# Altium schematic sheet 3_BUS_UART_ISO_Communication.schdoc
size 297 x 209 mm; Symbol: sucaimuban; Company: 嘉立创EDA; Version: V1.0; Page Size: A4; @Project Name: 26gsSucaiku; @Update Date: 2026-06-27; @Create Date: 2026-06-21; Device: sucaimuban; @Board Name: Sucaiku; @Page Name: BUS/UART_ISO_Communication; @Create Time: 21:33:33; @Page Count: 7; @Page No: 3; @Schematic Name: Schematic1; @Update Time: 20:01:32; @Assembly Variant: Basic; Border: 1; Title Block Position: 3; Size: A4; Width: 1170; Height: 825; Region Start: 1; X Region Count: 6; Y Region Count: 4; Blade Width: 10
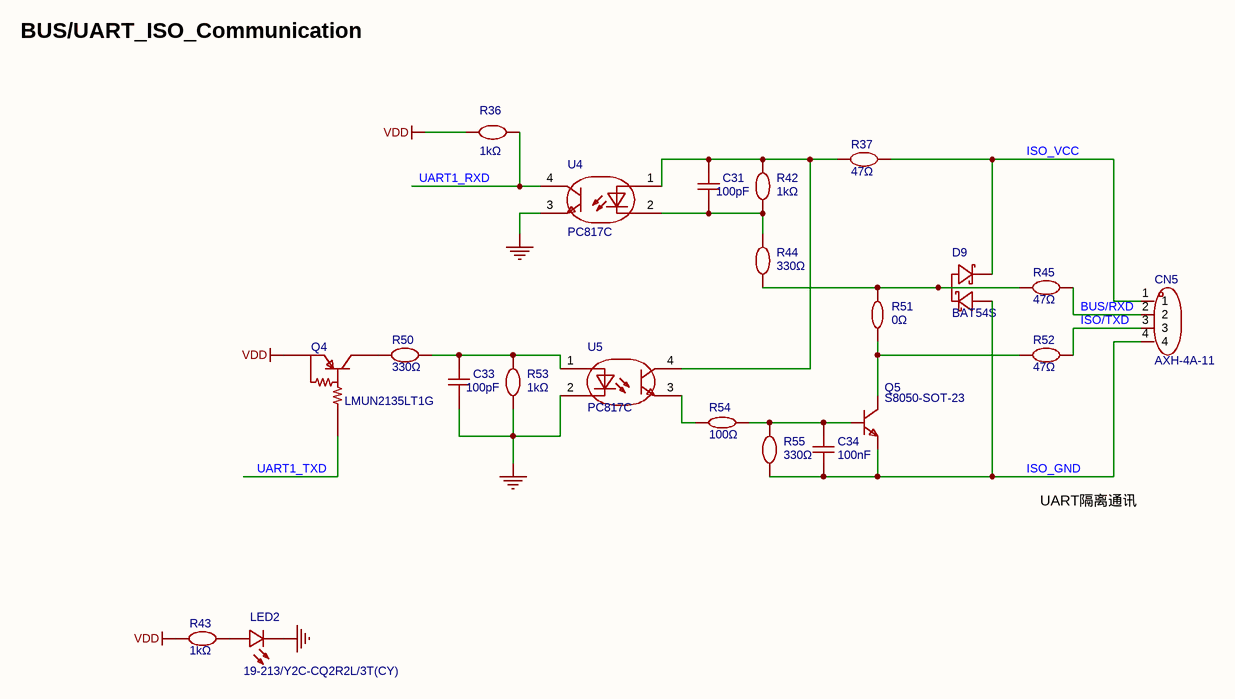
[diagram p0: 3_BUS_UART_ISO_Communication.schdoc]

## Parts
C31  100pF  [C0603]
C33  100pF  [C0603]
C34  100nF  [C0603]
CN5  AXH-4A-11  [CONN-TH_KH-XH-4A-Z]
D9  BAT54S  [SOT-23-3_L2.9-W1.3-P1.90-LS2.4-BR]
LED2  19-213/Y2C-CQ2R2L/3T(CY)  [LED0603-RD-YELLOW]
Q4  LMUN2135LT1G  [SOT-23-3_L2.9-W1.3-P1.90-LS2.4-BR]
Q5  S8050-SOT-23  [SOT-23-3_L2.9-W1.3-P1.90-LS2.5-BR]
R36  1kΩ  [R0603]
R37  47Ω  [R1206]
R42  1kΩ  [R0603]
R43  1kΩ  [R0603]
R44  330Ω  [R0805]
R45  47Ω  [R1206]
R50  330Ω  [R0805]
R51  0Ω  [R0603]
R52  47Ω  [R1206]
R53  1kΩ  [R0603]
R54  100Ω  [R0805]
R55  330Ω  [R0805]
U4  PC817C  [OPTO-SMD-4_L4.6-W6.5-P2.54-LS10.3-TL]
U5  PC817C  [OPTO-SMD-4_L4.6-W6.5-P2.54-LS10.3-TL]

## Nets
GND: C33.1 LED2.1(C) R53.1 U4.3 U5.2
VDD: Q4.2(E) R36.1 R43.2
BUS/RXD: CN5.2 R45.2
ISO/TXD: CN5.3 R52.2
ISO_GND: C34.2 CN5.4 D9.1(A) Q5.2(E) R55.1
ISO_VCC: CN5.1 D9.2(K) R37.2
UART1_RXD: R36.2 U4.4
UART1_TXD: Q4.1(B)
NetC31_1: C31.1 R42.1 R44.2 U4.2
NetC31_2: C31.2 R37.1 R42.2 U4.1 U5.4
NetC33_2: C33.2 R50.1 R53.2 U5.1
NetC34_1: C34.1 Q5.1(B) R54.2 R55.2
NetD9_3: D9.3 R44.1 R45.1 R51.2
NetLED2_2: LED2.2(A) R43.1
NetQ4_3: Q4.3(C) R50.2
NetQ5_3: Q5.3(C) R51.1 R52.1
NetR54_1: R54.1 U5.3

## Notes on the sheet
- BUS/UART_ISO_Communication
- UART隔离通讯
- 身份证号
- 选手姓名
- 手 机 号
- 图页名称
- 第                      幅
- 工程名称
- 共                    幅
- 当前日期
- 当前时间

## Library data of the parts
C31 C33 = CC0603JRNPO9BN101: 容值:100pF;精度:±5%;额定电压:50V;温度系数:NP0;; Manufacturer: YAGEO(国巨); AddInBom: yes; ModelId: ac125912035d415993ca9572d50418b1聨0819f05c4eef4c71ace90d822a990e87; ModelName: C0603_L1.6-W0.8-H0.8; ModelTransform: 62.992,31.496,0,0,0,0,0,0,0; Tolerance: ±5%; Voltage Rating: 50V; Temperature Coefficient: NP0; Symbol: CC0603JRNPO9BN101; Device: CC0603JRNPO9BN101; LCSC Part Name: 100pF ±5% 50V; SupplierPart: C14665; ManufacturerPart: CC0603JRNPO9BN101; Supplier Footprint: 0603; JLCPCB Part Class: Extended Part; Datasheet: https://item.szlcsc.com/datasheet/CC0603JRNPO9BN101/15333.html; Supplier: LCSC; ConvertToPcb: yes; FootprintName: C0603; Value: 100pF
C34 = CL10B104KB8NNNC: 容值:100nF;精度:±10%;额定电压:50V;温度系数:X7R;; Manufacturer: SAMSUNG(三星); AddInBom: yes; ModelId: ac125912035d415993ca9572d50418b1聨0819f05c4eef4c71ace90d822a990e87; ModelName: C0603_L1.6-W0.8-H0.8; ModelTransform: 62.992,31.496,0,0,0,0,0,0,0; Tolerance: ±10%; Voltage Rating: 50V; Temperature Coefficient: X7R; Symbol: CL10B104KB8NNNC; Device: CL10B104KB8NNNC; LCSC Part Name: 100nF ±10% 50V; SupplierPart: C1591; ManufacturerPart: CL10B104KB8NNNC; Supplier Footprint: 0603; JLCPCB Part Class: Extended Part; Datasheet: https://item.szlcsc.com/datasheet/CL10B104KB8NNNC/1943.html; Supplier: LCSC; ConvertToPcb: yes; FootprintName: C0603; Value: 100nF
CN5 = AXH-4A-11: 插针结构:1x4P;间距:2.5mm;安装方式:直插;参考系列:XH;总PIN数:4P;排数:1;每排PIN数:4;行距:2.5mm;额定电流:2A;触头材质:黄铜;触头镀层:锡;工作温度:-25℃~+85℃;; Manufacturer: JXTCONN(聚兴泰); AddInBom: yes; ModelId: 9492b9b5a702460f82b1decd06d0892a聨0819f05c4eef4c71ace90d822a990e87; ModelTransform: 492.125,232.283,0,0,0,0,0,21.654,-137.795; Pins Structure: 1x4P; Pitch: 2.5mm; Reference Series: XH; Number of PINs Per Row: 4; Current Rating: 2A; Voltage Rating: 250V; Plastic Material: PA66; Flame Retardant Rating: UL94V-0; Z-Height of the Board: 7mm; X-Length of Bottom Edge on Board (Spacing Line): 12.5mm; Y-Width of Bottom Edge on Board: 5.9mm; Symbol: AXH-4A-11; Device: AXH-4A-11; LCSC Part Name: 1x4P 间距:2.5mm 直插 系列:XH; SupplierPart: C42422439; ManufacturerPart: AXH-4A-11; Supplier Footprint: 插件,P=2.54mm; JLCPCB Part Class: Extended Part; Datasheet: https://item.szlcsc.com/datasheet/AXH-4A-11/44442050.html; Supplier: LCSC; ConvertToPcb: yes; FootprintName: CONN-TH_KH-XH-4A-Z; ModelName: CONN-TH_KH-XH-4A-Z; Mounting Type: 直插; Number of Pins: 4P; Number of Rows: 1; Row Spacing: 2.5mm; Contact Material: 黄铜; Contact Plating: 锡; Operating Temperature: -25℃~+85℃; Supplementary Features: -; Color: 白色
D9 = BAT54S_C916425: 二极管配置:1对串联式;正向压降(Vf):800mV@100mA;直流反向耐压(Vr):30V;整流电流:200mA;; Manufacturer: JSMSEMI(杰盛微); AddInBom: yes; ModelId: c62791f0466c4ae2a892c056b845b0ca聨0819f05c4eef4c71ace90d822a990e87; ModelName: SOT-23-3P_L2.9-W1.3-H1.0-LS2.4-P0.95; ModelTransform: 98.425,114.173,0,180,0,0,0.0005,-0.0005,0; Diode Configuration: 1对串联式; Voltage - DC Reverse(Vr): 30V; Current - Rectified: 200mA; Reverse Leakage Current (Ir): 2uA@25V; Non-Repetitive Peak Forward Surge Current: 600mA; Symbol: BAT54S_C916425; Device: BAT54S_C916425; LCSC Part Name: 电压:30V 电流:200mA; SupplierPart: C916425; ManufacturerPart: BAT54S; Supplier Footprint: SOT-23; JLCPCB Part Class: Extended Part; Datasheet: https://item.szlcsc.com/datasheet/BAT54S/990921.html; Supplier: LCSC; ConvertToPcb: yes; FootprintName: SOT-23-3_L2.9-W1.3-P1.90-LS2.4-BR; Voltage - Forward(Vf@If): 800mV@100mA
LED2 = 19-213/Y2C-CQ2R2L/3T(CY): 灯头类型:-;发光颜色:黄色;正向压降(Vf):1.7V~2.3V;功率:60mW;正向电流:20mA;波长:585.5nm~591.5nm;二极管配置:-;透镜颜色:无色透明透镜;色温:-;发光强度:90mcd~180mcd;发光角度:120°;载带方式:-;工作温度:-40℃~+85℃;; Manufacturer: EVERLIGHT(亿光); AddInBom: yes; ModelId: a8fc7d5425514cf49dd600af0a7bb223聨0819f05c4eef4c71ace90d822a990e87; ModelTransform: 63.7794,32.283,0,0,0,0,-1.969,0,0; Illumination Color: 黄色; Power(Watts): 60mW; Forward Current: 20mA; Peak Wavelength: 591nm; Lens Color: 无色透明透镜; Viewing Angle: 120°; Symbol: 19-213/Y2C-CQ2R2L/3T(CY); Device: 19-213/Y2C-CQ2R2L/3T(CY); LCSC Part Name: 黄灯; SupplierPart: C72038; ManufacturerPart: 19-213/Y2C-CQ2R2L/3T(CY); Supplier Footprint: 0603; JLCPCB Part Class: Extended Part; Supplier: LCSC; ConvertToPcb: yes; FootprintName: LED0603-RD-YELLOW; ModelName: LED0603-RD-YELLOW; Lamp Holder Type: -; Voltage - Forward(Vf): 1.7V~2.3V; Wavelength - Dominant: 585.5nm~591.5nm; Diode Configuration: -; Color Temperature: -; Luminous Intensity: 90mcd~180mcd; Mounting Style: -; Operating Temperature: -40℃~+85℃
Q4 = LMUN2135LT1G: 数量:-;集射极击穿电压(Vceo):50V;集电极电流(Ic):100mA;耗散功率(Pd):246mW;直流电流增益(hFE):80@5.0mA,10V;; Manufacturer: LRC(乐山无线电); AddInBom: yes; ModelId: c62791f0466c4ae2a892c056b845b0ca聨0819f05c4eef4c71ace90d822a990e87; ModelName: SOT-23-3P_L2.9-W1.3-H1.0-LS2.4-P0.95; ModelTransform: 98.425,114.173,0,180,0,0,0.0005,-0.0005,0; Collector - Emitter Voltage VCEO: 50V; Current - Collector(Ic): 100mA; Pd - Power Dissipation: 246mW; type: PNP; Output Voltage(VO(on)): 200mV; Input Resistor: 2.2kΩ; Resistor Ratio: 0.047; Symbol: LMUN2135LT1G; Device: LMUN2135LT1G; LCSC Part Name: 偏置电阻晶体管; SupplierPart: C136189; ManufacturerPart: LMUN2135LT1G; Supplier Footprint: SOT-23; JLCPCB Part Class: Extended Part; Datasheet: https://item.szlcsc.com/datasheet/LMUN2135LT1G/147503.html; Supplier: LCSC; ConvertToPcb: yes; FootprintName: SOT-23-3_L2.9-W1.3-P1.90-LS2.4-BR; Number: -; DC Current Gain: 80@5.0mA,10V; Operating Temperature: -55℃~+150℃
Q5 = S8050-SOT-23: 晶体管类型：NPN。                 集电极电流ICM:0.5A                   集电极-基极击穿电压BVCBO:40V         集电极-发射极击穿电压BVCEO:25V       直流电流增益HFE:200-350                        丝印：J3Y; Manufacturer: DDF(鼎德丰); AddInBom: yes; ModelId: 6ea1b42e609b4c388d37f6ca14da8e20聨0819f05c4eef4c71ace90d822a990e87; ModelTransform: 114.173,98.425,0,90,0,0,0.001,-0.001,0; Symbol: S8050-SOT-23; Device: S8050-SOT-23; LCSC Part Name: S8050-SOT-23; SupplierPart: C50229533; ManufacturerPart: S8050-SOT-23; Supplier Footprint: SOT-23; JLCPCB Part Class: Extended Part; Datasheet: https://item.szlcsc.com/datasheet/S8050-SOT-23/52814686.html; Supplier: LCSC; ConvertToPcb: yes; FootprintName: SOT-23-3_L2.9-W1.3-P1.90-LS2.5-BR; ModelName: SOT-23-3_L2.9-W1.3-P1.90-LS2.5-BR
R36 R42 R43 R53 = AST031KF: 阻值:1kΩ;精度:±1%;功率:100mW;工作电压:75V;温度系数:±100ppm/℃;; Manufacturer: HKR(香港电阻); 3D Model: fc143cca1e79419f9cd78b61e9279f08聨0819f05c4eef4c71ace90d822a990e87; 3D Model Transform: 31.8897,63.7794,0,90,0,0,0,0,0; Tolerance: ±1%; Power(Watts): 100mW; Voltage-Supply(Max): 75V; AddInBom: yes; Symbol: AST031KF; Device: AST031KF; LCSC Part Name: 1K ±1%; Supplier Part: C49330120; Manufacturer Part: AST031KF; Supplier Footprint: 0603; JLCPCB Part Class: Extended Part; Datasheet: https://item.szlcsc.com/datasheet/AST031KF/51811762.html; Supplier: LCSC; Value: 1kΩ; Temperature Coefficient: ±100ppm/℃; Operating Temperature: -55℃~+155℃; ConvertToPcb: yes; FootprintName: R0603; ModelName: R0603
R37 R45 R52 = FRC1206J470 TS: 电阻类型:厚膜电阻;阻值:47Ω;精度:±5%;功率:250mW;工作电压:200V;温度系数:±100ppm/℃;; Manufacturer: FOJAN(富捷); AddInBom: yes; ModelId: 89a1f13db2384da588040e0b3c55bf66聨0819f05c4eef4c71ace90d822a990e87; ModelName: R1206_L3.2-W1.6-H0.6; ModelTransform: 125.984,62.992,0,0,0,0,0,0,0; Tolerance: ±5%; Power(Watts): 250mW; Voltage-Supply(Max): 200V; Symbol: FRC1206J470 TS; Device: FRC1206J470 TS; LCSC Part Name: 47Ω ±5% 250mW 厚膜电阻; SupplierPart: C2907508; ManufacturerPart: FRC1206J470 TS; Supplier Footprint: 1206; JLCPCB Part Class: Extended Part; Supplier: LCSC; ConvertToPcb: yes; FootprintName: R1206; Type: 厚膜电阻; Value: 47Ω; Temperature Coefficient: ±100ppm/℃; Operating Temperature: -55℃~+155℃
R44 R50 R55 = FRC0805J331 TS: 电阻类型:厚膜电阻;阻值:330Ω;精度:±5%;功率:125mW;工作电压:150V;温度系数:±100ppm/℃;; Manufacturer: FOJAN(富捷); AddInBom: yes; ModelId: 37a81e68749a4138bd2dfa6897b24b85聨0819f05c4eef4c71ace90d822a990e87; ModelName: R0805_L2.0-W1.3-H0.6; ModelTransform: 78.74,51.181,0,0,0,0,0,-0.0005,0; Tolerance: ±5%; Power(Watts): 125mW; Voltage-Supply(Max): 150V; Symbol: FRC0805J331 TS; Device: FRC0805J331 TS; LCSC Part Name: 330Ω ±5% 125mW 厚膜电阻; SupplierPart: C2907321; ManufacturerPart: FRC0805J331 TS; Supplier Footprint: 0805; JLCPCB Part Class: Extended Part; Supplier: LCSC; ConvertToPcb: yes; FootprintName: R0805; Type: 厚膜电阻; Value: 330Ω; Temperature Coefficient: ±100ppm/℃; Operating Temperature: -55℃~+155℃
R51 = RC0603JR-070RL: 电阻类型:厚膜电阻;阻值:0Ω;精度:±5%;功率:100mW;工作电压:75V;温度系数:-;; Manufacturer: YAGEO(国巨); AddInBom: yes; ModelId: fc143cca1e79419f9cd78b61e9279f08聨0819f05c4eef4c71ace90d822a990e87; ModelTransform: 31.8897,63.7794,0,90,0,0,0,0,0; Tolerance: ±5%; Power(Watts): 100mW; Voltage-Supply(Max): 75V; Symbol: RC0603JR-070RL; Device: RC0603JR-070RL; LCSC Part Name: 厚膜电阻 0Ω ±5% 100mW; SupplierPart: C95177; ManufacturerPart: RC0603JR-070RL; Supplier Footprint: 0603; JLCPCB Part Class: Extended Part; Datasheet: https://item.szlcsc.com/datasheet/RC0603JR-070RL/96378.html; Supplier: LCSC; ConvertToPcb: yes; FootprintName: R0603; ModelName: R0603; Type: 厚膜电阻; Value: 0Ω; Temperature Coefficient: -; Operating Temperature: -55℃~+155℃
R54 = AC0805FR-07100RL: 电阻类型:厚膜电阻;阻值:100Ω;精度:±1%;功率:125mW;工作电压:150V;温度系数:±100ppm/℃;; Manufacturer: YAGEO(国巨); AddInBom: yes; ModelId: 37a81e68749a4138bd2dfa6897b24b85聨0819f05c4eef4c71ace90d822a990e87; ModelName: R0805_L2.0-W1.3-H0.6; ModelTransform: 78.74,51.181,0,0,0,0,0,-0.0005,0; Tolerance: ±1%; Power(Watts): 125mW; Voltage-Supply(Max): 150V; Symbol: AC0805FR-07100RL; Device: AC0805FR-07100RL; LCSC Part Name: 厚膜电阻 100Ω ±1% 125mW; SupplierPart: C138274; ManufacturerPart: AC0805FR-07100RL; Supplier Footprint: 0805; JLCPCB Part Class: Extended Part; Datasheet: https://item.szlcsc.com/datasheet/AC0805FR-07100RL/149590.html; Supplier: LCSC; ConvertToPcb: yes; FootprintName: R0805; Type: 厚膜电阻; Value: 100Ω; Temperature Coefficient: ±100ppm/℃; Operating Temperature: -55℃~+155℃
U4 U5 = PC817C_C3025164: 输入类型:DC;正向压降(Vf):1.2V;输出电流:50mA;隔离电压(Vrms):5kV;直流反向耐压(Vr):6V;负载电压:35V;输出通道数:1;集射极饱和电压(VCE(sat)):100mV@1mA,20mA;; Manufacturer: GOODWORK(固得沃克); AddInBom: yes; ModelId: 2d94a81bf94f4608bff03a785b63c361聨0819f05c4eef4c71ace90d822a990e87; ModelName: OPTO-SMD-4_L4.6-W6.5-H3.6-LS10.2-P2.54; ModelTransform: 401.574,181.102,0,0,0,0,0,0,0; Input type: DC; Output Type: 光电三极管; Voltage - Forward(Vf): 1.2V; Output Current: 50mA; Isolation Voltage(Vrms): 5kV; Reverse Voltage: 6V; Load Voltage: 35V; Number of Outputs: 1; Rise time: 6us@2mA,100Ω; Fall time: 5us; Current Transfer Ratio (CTR) Minimum: 200%; Current Transfer Ratio (CTR) Maximum/Saturation Value: 400%; Symbol: PC817C_C3025164; Device: PC817C_C3025164; LCSC Part Name: C档 光电晶体管光电耦合器; SupplierPart: C3025164; ManufacturerPart: PC817C; Supplier Footprint: SMD-4P; JLCPCB Part Class: Extended Part; Datasheet: https://item.szlcsc.com/datasheet/PC817C/3553773.html; Supplier: LCSC; ConvertToPcb: yes; FootprintName: OPTO-SMD-4_L4.6-W6.5-P2.54-LS10.3-TL; Vce Saturation(VCE(sat)): 100mV@1mA,20mA; Operating Temperature: -55℃~+110℃; Forward Current(If): 50mA